# EAGLE design BitBeaconS (EAGLE 7.3.0)
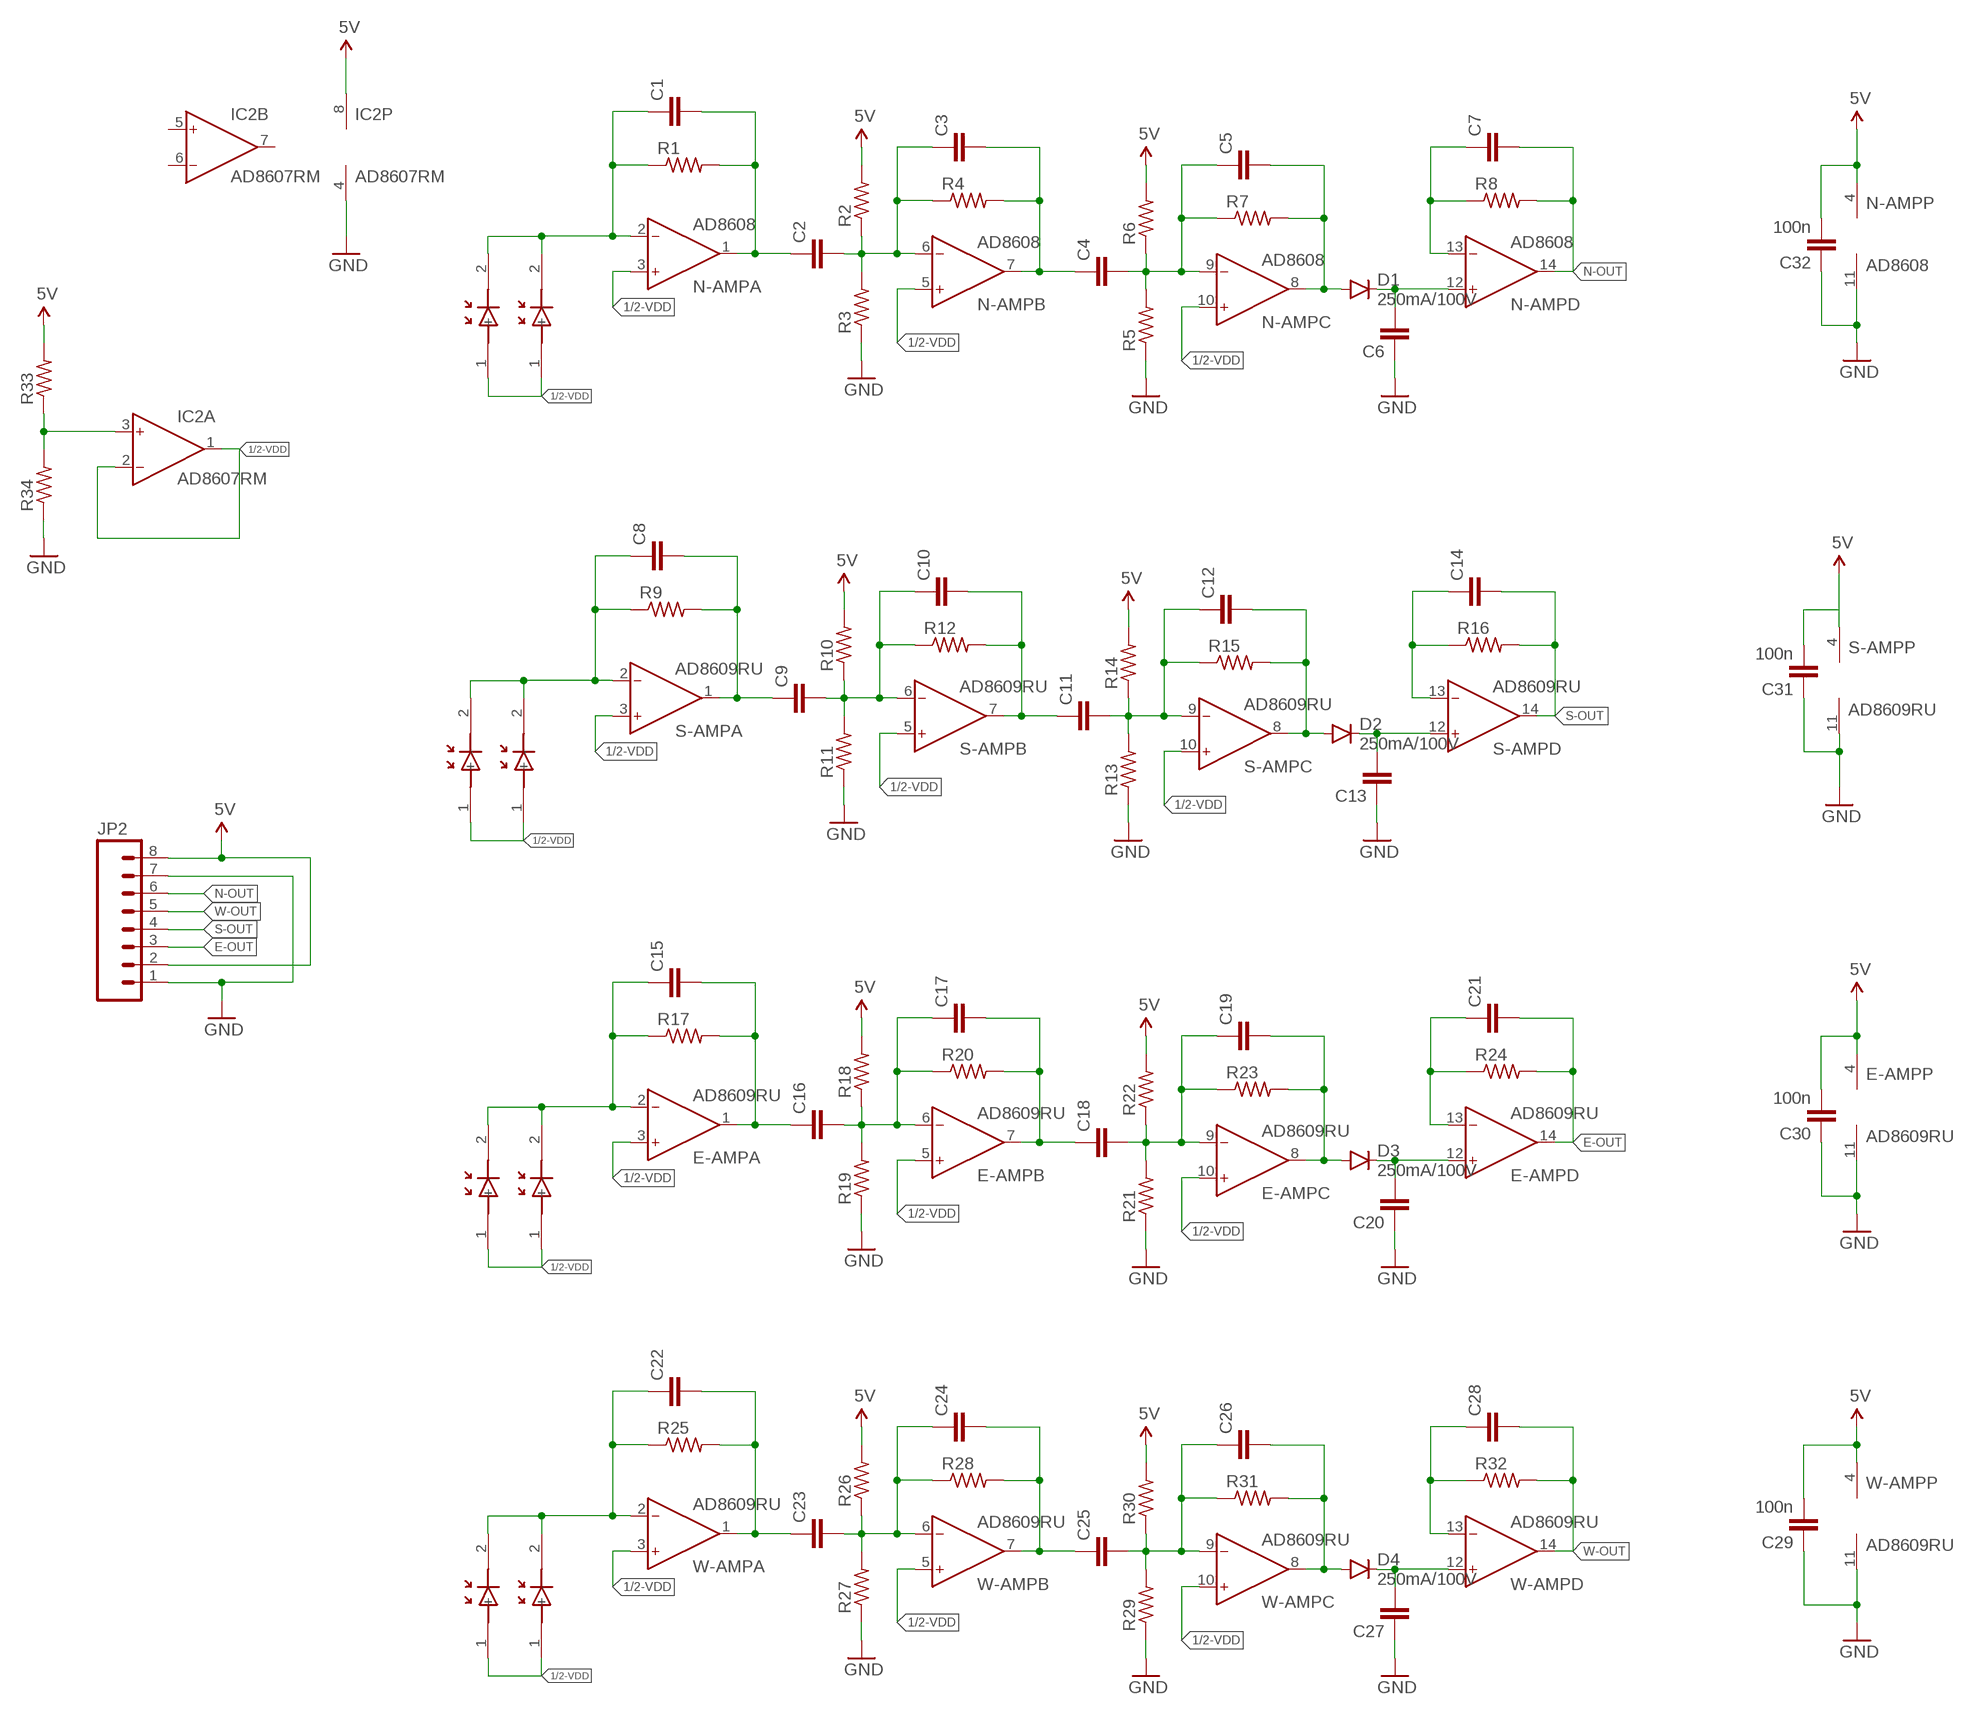
[diagram p0: schematic, sheet 1]

## Parts
C1  C-EUC0805  [C0805]
C2  C-EUC0805  [C0805]
C3  C-EUC0805  [C0805]
C4  C-EUC0805  [C0805]
C5  C-EUC0805  [C0805]
C6  C-EUC0805  [C0805]
C7  C-EUC0805  [C0805]
C8  C-EUC0805  [C0805]
C9  C-EUC0805  [C0805]
C10  C-EUC0805  [C0805]
C11  C-EUC0805  [C0805]
C12  C-EUC0805  [C0805]
C13  C-EUC0805  [C0805]
C14  C-EUC0805  [C0805]
C15  C-EUC0805  [C0805]
C16  C-EUC0805  [C0805]
C17  C-EUC0805  [C0805]
C18  C-EUC0805  [C0805]
C19  C-EUC0805  [C0805]
C20  C-EUC0805  [C0805]
C21  C-EUC0805  [C0805]
C22  C-EUC0805  [C0805]
C23  C-EUC0805  [C0805]
C24  C-EUC0805  [C0805]
C25  C-EUC0805  [C0805]
C26  C-EUC0805  [C0805]
C27  C-EUC0805  [C0805]
C28  C-EUC0805  [C0805]
C29  100n  C-EUC0805  [C0805]
C30  100n  C-EUC0805  [C0805]
C31  100n  C-EUC0805  [C0805]
C32  100n  C-EUC0805  [C0805]
D1  250mA/100V  DIODEBAS16  [SOD-323]
D2  250mA/100V  DIODEBAS16  [SOD-323]
D3  250mA/100V  DIODEBAS16  [SOD-323]
D4  250mA/100V  DIODEBAS16  [SOD-323]
E-AMP  AD8609RU  [TSSOP14]
E-PD  BPW46  [PIN-PHOTODIODE]
E-PD1  BPW46  [PIN-PHOTODIODE]
IC2  AD8607RM  [MSOP08]
JP2  M08NO_SILK  [1X08_PIN1_NO_SILK]
N-AMP  AD8608  AD8609RU  [TSSOP14]
N-PD  BPW46  [PIN-PHOTODIODE]
N-PD1  BPW46  [PIN-PHOTODIODE]
R1  R-US_R0805  [R0805]
R2  R-US_R0805  [R0805]
R3  R-US_R0805  [R0805]
R4  R-US_R0805  [R0805]
R5  R-US_R0805  [R0805]
R6  R-US_R0805  [R0805]
R7  R-US_R0805  [R0805]
R8  R-US_R0805  [R0805]
R9  R-US_R0805  [R0805]
R10  R-US_R0805  [R0805]
R11  R-US_R0805  [R0805]
R12  R-US_R0805  [R0805]
R13  R-US_R0805  [R0805]
R14  R-US_R0805  [R0805]
R15  R-US_R0805  [R0805]
R16  R-US_R0805  [R0805]
R17  R-US_R0805  [R0805]
R18  R-US_R0805  [R0805]
R19  R-US_R0805  [R0805]
R20  R-US_R0805  [R0805]
R21  R-US_R0805  [R0805]
R22  R-US_R0805  [R0805]
R23  R-US_R0805  [R0805]
R24  R-US_R0805  [R0805]
R25  R-US_R0805  [R0805]
R26  R-US_R0805  [R0805]
R27  R-US_R0805  [R0805]
R28  R-US_R0805  [R0805]
R29  R-US_R0805  [R0805]
R30  R-US_R0805  [R0805]
R31  R-US_R0805  [R0805]
R32  R-US_R0805  [R0805]
R33  R-US_R0805  [R0805]
R34  R-US_R0805  [R0805]
S-AMP  AD8609RU  [TSSOP14]
S-PD  BPW46  [PIN-PHOTODIODE]
S-PD1  BPW46  [PIN-PHOTODIODE]
W-AMP  AD8609RU  [TSSOP14]
W-PD  BPW46  [PIN-PHOTODIODE]
W-PD1  BPW46  [PIN-PHOTODIODE]

## Nets
1/2-VDD: E-AMP.3(A:IN+) E-AMP.5(B:IN+) E-AMP.10(C:IN+) E-PD1.1(+) E-PD.1(+) IC2.1(A:OUT) IC2.2(A:IN-) N-AMP.3(A:IN+) N-AMP.5(B:IN+) N-AMP.10(C:IN+) N-PD1.1(+) N-PD.1(+) S-AMP.3(A:IN+) S-AMP.5(B:IN+) S-AMP.10(C:IN+) S-PD1.1(+) S-PD.1(+) W-AMP.3(A:IN+) W-AMP.5(B:IN+) W-AMP.10(C:IN+) W-PD1.1(+) W-PD.1(+)
5V: C29.2 C30.2 C31.2 C32.2 E-AMP.4(P:V+) IC2.8(P:V+) JP2.2 JP2.8 N-AMP.4(P:V+) R2.2 R6.2 R10.2 R14.2 R18.2 R22.2 R26.2 R30.2 R33.2 S-AMP.4(P:V+) W-AMP.4(P:V+)
E-OUT: C21.2 E-AMP.14(D:OUT) JP2.3 R24.2
GND: C6.1 C13.1 C20.1 C27.1 C29.1 C30.1 C31.1 C32.1 E-AMP.11(P:V-) IC2.4(P:V-) JP2.1 JP2.7 N-AMP.11(P:V-) R3.1 R5.1 R11.1 R13.1 R19.1 R21.1 R27.1 R29.1 R34.1 S-AMP.11(P:V-) W-AMP.11(P:V-)
N$1: C1.1 N-AMP.2(A:IN-) N-PD1.2(-) N-PD.2(-) R1.1
N$2: C6.2 D1.C N-AMP.12(D:IN+)
N$3: C1.2 C2.1 N-AMP.1(A:OUT) R1.2
N$4: C8.1 R9.1 S-AMP.2(A:IN-) S-PD1.2(-) S-PD.2(-)
N$5: C2.2 C3.1 N-AMP.6(B:IN-) R2.1 R3.2 R4.1
N$6: C3.2 C4.1 N-AMP.7(B:OUT) R4.2
N$7: C4.2 C5.1 N-AMP.9(C:IN-) R5.2 R6.1 R7.1
N$8: C5.2 D1.A N-AMP.8(C:OUT) R7.2
N$9: IC2.3(A:IN+) R33.1 R34.2
N$11: C7.1 N-AMP.13(D:IN-) R8.1
N$12: C9.2 C10.1 R10.1 R11.2 R12.1 S-AMP.6(B:IN-)
N$13: C10.2 C11.1 R12.2 S-AMP.7(B:OUT)
N$14: C11.2 C12.1 R13.2 R14.1 R15.1 S-AMP.9(C:IN-)
N$15: C12.2 D2.A R15.2 S-AMP.8(C:OUT)
N$16: C13.2 D2.C S-AMP.12(D:IN+)
N$18: C14.1 R16.1 S-AMP.13(D:IN-)
N$19: C15.1 E-AMP.2(A:IN-) E-PD1.2(-) E-PD.2(-) R17.1
N$20: C15.2 C16.1 E-AMP.1(A:OUT) R17.2
N$21: C16.2 C17.1 E-AMP.6(B:IN-) R18.1 R19.2 R20.1
N$22: C17.2 C18.1 E-AMP.7(B:OUT) R20.2
N$23: C18.2 C19.1 E-AMP.9(C:IN-) R21.2 R22.1 R23.1
N$24: C19.2 D3.A E-AMP.8(C:OUT) R23.2
N$25: C20.2 D3.C E-AMP.12(D:IN+)
N$27: C21.1 E-AMP.13(D:IN-) R24.1
N$28: C22.1 R25.1 W-AMP.2(A:IN-) W-PD1.2(-) W-PD.2(-)
N$29: C22.2 C23.1 R25.2 W-AMP.1(A:OUT)
N$30: C23.2 C24.1 R26.1 R27.2 R28.1 W-AMP.6(B:IN-)
N$31: C24.2 C25.1 R28.2 W-AMP.7(B:OUT)
N$32: C25.2 C26.1 R29.2 R30.1 R31.1 W-AMP.9(C:IN-)
N$33: C26.2 D4.A R31.2 W-AMP.8(C:OUT)
N$34: C27.2 D4.C W-AMP.12(D:IN+)
N$36: C28.1 R32.1 W-AMP.13(D:IN-)
N-OUT: C7.2 JP2.6 N-AMP.14(D:OUT) R8.2
S-AMP: C8.2 C9.1 R9.2 S-AMP.1(A:OUT)
S-OUT: C14.2 JP2.4 R16.2 S-AMP.14(D:OUT)
W-OUT: C28.2 JP2.5 R32.2 W-AMP.14(D:OUT)
Unconnected: IC2.5(B:IN+) IC2.6(B:IN-) IC2.7(B:OUT)

## Library data of the parts
C1-C32 = resistor:C-EU: CAPACITOR, European symbol
D1-D4 = SparkFun-DiscreteSemi:DIODE: Diode These are standard reverse protection diodes and small signal diodes. SMA package can handle up to about 1A. SOD-323 can handle about 200mA. What the SOD-323 package when ordering, there are some mfgs out there that are 5-pin packages.; PROD_ID: DIO-09646
E-AMP N-AMP S-AMP W-AMP = analog-devices:AD8609: Precision Micropower, Low Noise CMOS, Rail-to-Rail Input/Output Operational Amplifiers Source: http://www.analog.com/static/imported-files/data_sheets/AD8603_8607_8609.pdf; MF: ALTERA CORPORATION; MPN: AD8609ARUZ; OC_FARNELL: 1464994; OC_NEWARK: 59K6934
E-PD E-PD1 N-PD N-PD1 S-PD S-PD1 W-PD W-PD1 = Orlando:BPW46
IC2 = analog-devices:AD8607: Precision Micropower, Low Noise CMOS, Rail-to-Rail Input/Output Operational Amplifiers Source: http://www.analog.com/static/imported-files/data_sheets/AD8603_8607_8609.pdf; MF: ALTERA CORPORATION; MPN: AD8607ARMZ-REEL; OC_FARNELL: 1464990; OC_NEWARK: 59K6925
JP2 = SparkFun-Connectors:M08: Header 8 Standard 8-pin 0.1" header. Use with straight break away headers (SKU : PRT-00116), right angle break away headers (PRT-00553), swiss pins (PRT-00743), machine pins (PRT-00117), and female headers (PRT-00115).
R1-R34 = resistor:R-US_: RESISTOR, American symbol

## Board
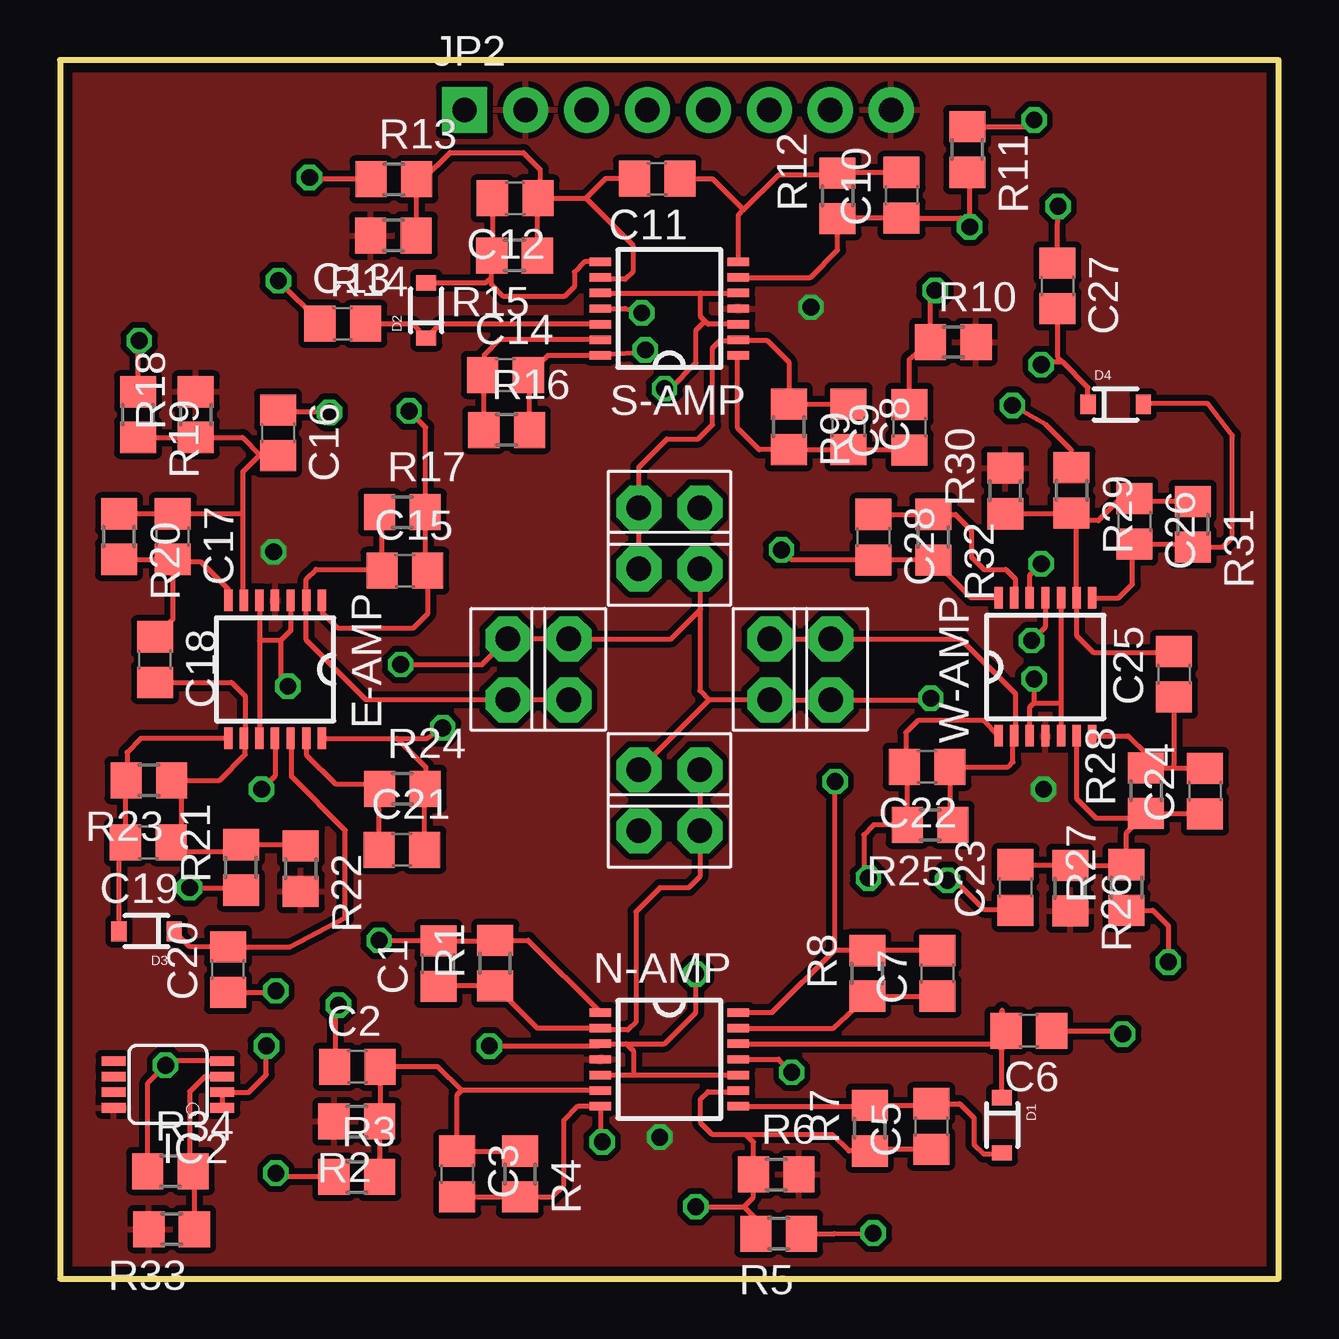
[diagram p1: board, top side]
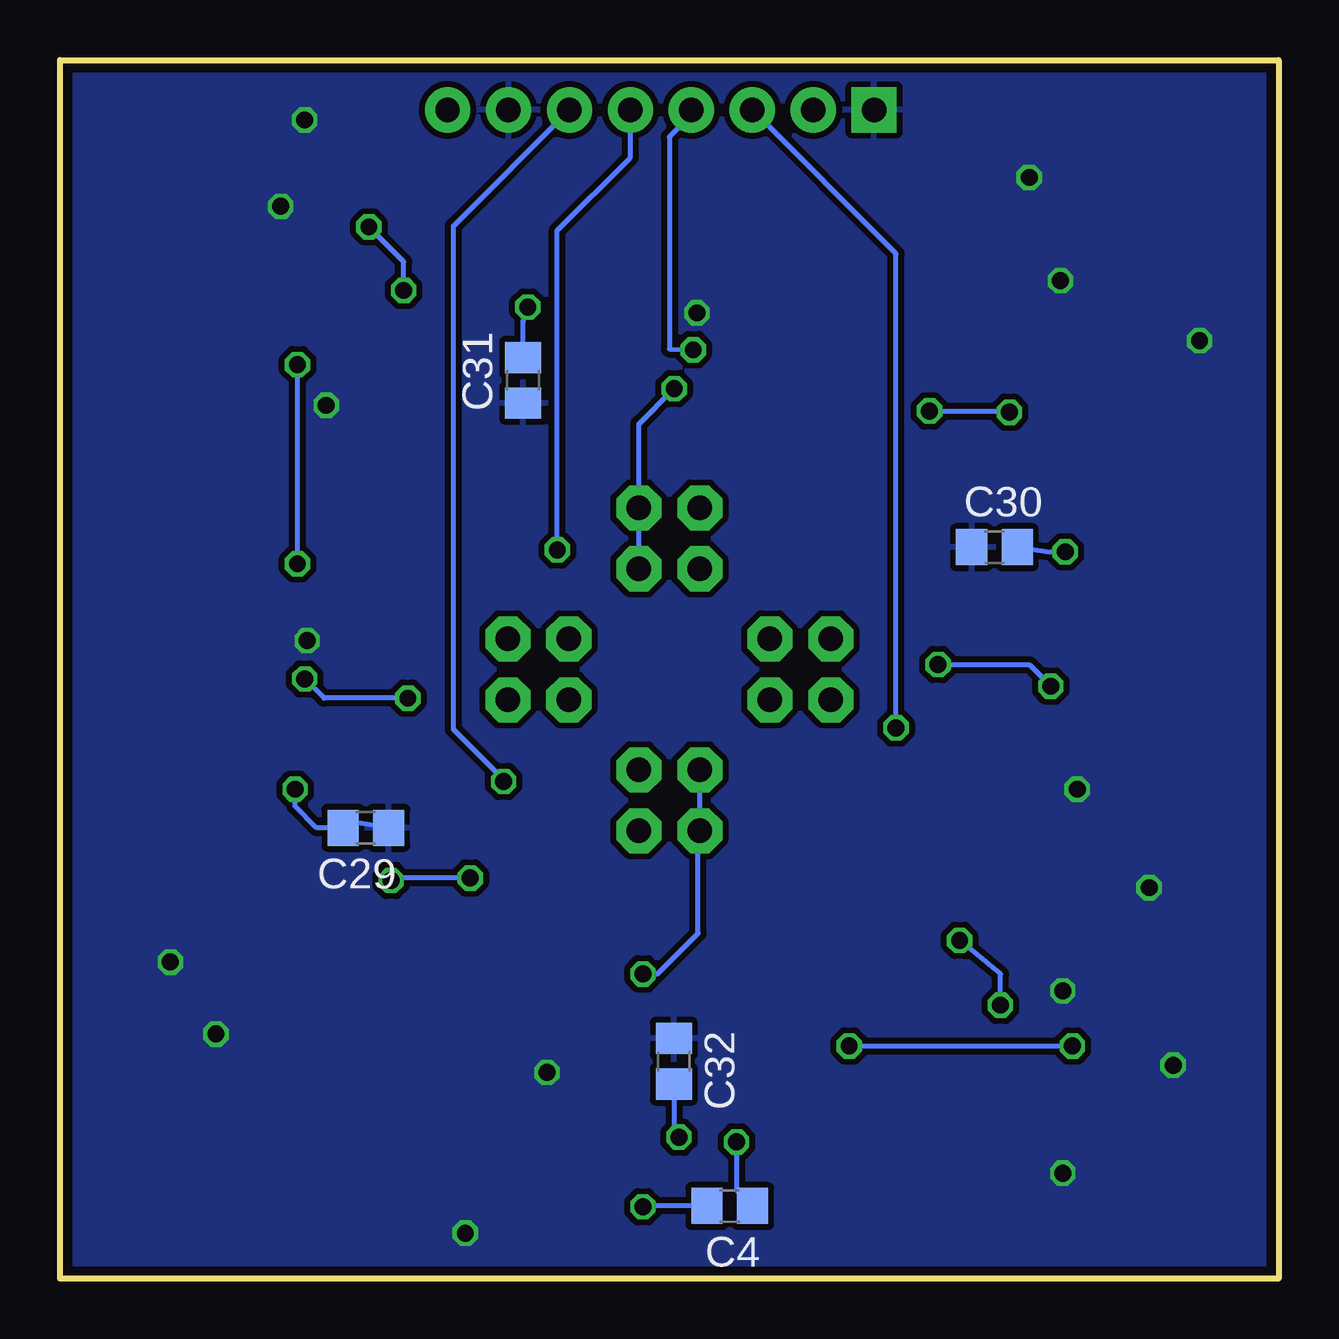
[diagram p2: board, bottom side, seen from below]

Size 50.8 x 50.8 mm. Coordinates in mm from the lower left corner, seen from the top.
Outline: 0,0 50.8,0 50.8,50.8 0,50.8 0,0
Copper layers (1*16): Top 0.0356mm / dielectric 1.5011mm / Bottom 0.0356mm
Design rules "LaenPCBOrder": minimum track width 6mil, minimum drill 13mil, track to track 6mil, track to pad 6mil, pad to pad 6mil, via to via 6mil, smd to smd 6mil, copper to edge 15mil, drill to drill 6mil, minimum pad ring 7mil, minimum via ring 7mil, stop-mask expansion 3mil, vias tented up to drill 0mil, thermal gap 10mil

### Footprints (pad centres in the part's own frame; a part is rotated, then mirrored left to right if it is on the bottom)
C0805 = smd 1.3 x 1.5: 1 -0.95,0; 2 0.95,0
SOD-323 = smd 0.63 x 0.83: A 1.15,0; C -1.15,0
TSSOP14 = smd 0.9 x 0.35: 1 -2.875,1.95; 2 -2.875,1.3; 3 -2.875,0.65; 4 -2.875,0; 5 -2.875,-0.65; 6 -2.875,-1.3; 7 -2.875,-1.95; 8 2.875,-1.95; 9 2.875,-1.3; 10 2.875,-0.65; 11 2.875,0; 12 2.875,0.65; 13 2.875,1.3; 14 2.875,1.95
PIN-PHOTODIODE = drill 1.016 pad 1.88 octagon: 1 -1.27,0; 2 1.27,0
MSOP08 = smd 0.4 x 1: 1 -0.976,-2.263; 2 -0.326,-2.263; 3 0.324,-2.263; 4 0.974,-2.263; 5 0.974,2.262; 6 0.324,2.262; 7 -0.326,2.262; 8 -0.976,2.262
1X08_PIN1_NO_SILK = drill 1.016 pad 1.88 square: 1 0,0 | drill 1.016 pad 1.88: 2 2.54,0; 3 5.08,0; 4 7.62,0; 5 10.16,0; 6 12.7,0; 7 15.24,0; 8 17.78,0
R0805 = smd 1.3 x 1.5: 1 -0.95,0; 2 0.95,0

### Placement (x,y rotation side)
C1  15.77,13.13 90 top
C2  12.4,8.84 0 top
C3  16.56,4.37 270 top
C4  22.88,3.03 180 bottom
C5  36.32,6.35 90 top
C6  40.39,10.34 180 top
C7  36.58,12.73 90 top
C8  32.87,35.51 270 top
C9  35.41,35.48 90 top
C10  35.08,45.16 90 top
C11  24.89,45.85 180 top
C12  18.97,45.03 180 top
C13  11.79,39.8 0 top
C14  18.57,37.67 0 top
C15  14.38,29.51 0 top
C16  9.09,35.26 270 top
C17  4.7,30.94 270 top
C18  3.96,25.81 270 top
C19  3.68,18.19 180 top
C20  7.01,12.89 90 top
C21  14.25,17.88 0 top
C22  36.14,21.34 180 top
C23  39.83,16.31 90 top
C24  47.73,20.32 90 top
C25  46.43,25.2 90 top
C26  44.78,31.57 270 top
C27  41.58,41.38 270 top
C28  33.91,30.91 270 top
C29  38.05,18.79 180 bottom
C30  11.85,30.49 0 bottom
C31  31.5,37.45 90 bottom
C32  25.22,9.07 270 bottom
D1  39.27,6.4 270 top
D2  15.27,40.36 90 top
D3  3.61,14.48 180 top
D4  44,36.44 0 top
E-AMP  8.97,25.4 270 top
E-PD  21.21,25.4 270 top
E-PD1  18.67,25.4 270 top
IC2  4.5,8.1 90 top
JP2  16.87,48.72 0 top
N-AMP  25.4,9.14 0 top
N-PD  25.4,21.21 0 top
N-PD1  25.4,18.67 0 top
R1  18.14,13.16 90 top
R2  12.37,6.55 180 top
R3  12.37,4.24 0 top
R4  19.18,4.37 270 top
R5  29.96,1.88 180 top
R6  29.86,4.34 0 top
R7  33.76,6.27 90 top
R8  33.66,12.73 90 top
R9  30.38,35.51 270 top
R10  37.24,39.04 0 top
R11  37.82,47.07 270 top
R12  32.41,45.14 90 top
R13  13.92,45.82 0 top
R14  13.89,43.48 180 top
R15  18.95,42.65 180 top
R16  18.62,35.38 0 top
R17  14.27,31.95 0 top
R18  5.66,36.02 90 top
R19  3.25,36.02 270 top
R20  2.46,30.94 270 top
R21  7.54,17.14 90 top
R22  10.03,17.09 270 top
R23  3.71,20.78 180 top
R24  14.27,20.42 0 top
R25  36.27,18.91 180 top
R26  42.11,16.28 270 top
R27  44.45,16.31 90 top
R28  45.26,20.35 90 top
R29  42.16,32.86 270 top
R30  39.4,32.84 90 top
R31  47.22,31.45 270 top
R32  36.4,30.91 270 top
R33  4.66,2.06 180 top
R34  4.61,4.48 0 top
S-AMP  25.4,40.44 180 top
S-PD  25.4,29.59 180 top
S-PD1  25.4,32.13 180 top
W-AMP  41.07,25.5 90 top
W-PD  29.59,25.4 90 top
W-PD1  32.13,25.4 90 top

### Tracks (layer width: path | path; a pad name or v marks a point on that pad's centre or on a via)
1/2-VDD  (via drill 0.7)
  Top 0.203: N-AMP.5 23.9,8.49 | 23.9,8.49 N-AMP.10 | 23.61,9.79 N-AMP.3 22.43,9.7 v17.9,9.7 | 23.61,9.79 23.9,9.5 23.9,8.49 | E-AMP.5 8.32,26.6 | 8.32,26.6 E-AMP.10 | E-AMP.3 9.62,27.02 9.2,26.6 | 9.2,26.6 8.32,26.6 | IC2.1 IC2.2 7.87,7.77 8.6,8.5 v8.6,9.7 | 23.61,9.79 25.19,9.79 26.5,11.1 v26.5,12.7 | S-AMP.10 26.7,41.09 | 26.7,41.09 S-AMP.5 | S-AMP.3 27.01,39.79 26.89,39.91 | 26.89,39.91 26.7,40.1 26.7,41.09 | W-AMP.10 41.72,24 | 41.72,24 W-AMP.5 | W-AMP.3 40.42,23.82 40.6,24 | 40.6,24 41.72,24 | v36.3,24.2 36.23,24.13 W-PD1.1 W-PD.1 27.05,24.13 | v40.6,25 40.6,24 | 27.05,24.13 N-PD.1 | 27.05,24.13 26.67,24.51 S-PD.1 26.7,29.56 26.7,27.9 25.47,26.67 E-PD.1 E-PD1.1 17.6,25.6 v14.2,25.6 | v25.2,37.1 25.44,37.1 26.52,38.18 26.52,39.55 26.89,39.91 | 9.2,26.6 9.2,25 v9.5,24.7
  Bottom 0.203: v26.5,12.7 25.9,12.7 24.2,14.4 24.2,18.6 N-PD1.1 N-PD.1 | S-PD.1 S-PD1.1 26.67,35.63 v25.2,37.1 | v36.3,24.2 39.8,24.2 v40.6,25 | v14.2,25.6 10.4,25.6 v9.5,24.7 | v17.9,9.7 v8.6,9.7
5V  (via drill 0.7)
  Bottom 0.203: C32.2 25.22,6.12 v25,5.9 | C30.2 9.49,30.29 v8.9,30.3 | C31.2 31.5,39.9 v31.3,40.5 | C29.2 40.09,18.8 41,19.7 v41,20.4
  pour Top (isolate 0.254): 50.8,50.8 50.8,0 0,0 0,50.8
E-OUT  (via drill 0.7)
  Top 0.203: C21.2 15.2,20.4 R24.2 15.24,20.44 15.24,21.34 14.05,22.52 | E-AMP.14 14.05,22.52 | 14.05,22.52 15.31,22.52 v15.95,22.96
  Bottom 0.203: v15.95,22.96 15.95,42.72 JP2.3
GND  (via drill 0.7)
  Top 0.203: R3.1 9.16,4.24 v9,4.4 | N-AMP.11 29.96,9.14 v30.5,8.6 | R5.1 32.28,1.88 v33.9,1.9 | E-AMP.11 8.97,20.97 v8.4,20.4 | v5.4,16.3 7.44,16.3 R21.1 | IC2.4 4.57,9.07 v4.4,8.9 3.66,8.16 R34.1 | S-AMP.11 23.56,40.44 v24.25,40.26 | C13.1 10.84,39.86 v9.1,41.6 | R13.1 10.48,45.82 v10.4,45.9 | R19.1 3.25,39.05 v3.3,39.1 | C27.1 41.58,43.28 v41.6,44.7 | R29.1 42.16,34.54 41.1,35.6 v39.7,36.4 | W-AMP.11 41.07,27.17 v40.5,26.6 | R11.1 40.32,48.02 v40.6,48.3 | R27.1 45.54,15.36 46.2,14.7 v46.2,13.2 | C6.1 44.16,10.34 v44.3,10.2 | C20.1 8.94,11.94 v9,12
  Bottom 0.203: C29.1 39,19.1 39.1,19.2
  pour Bottom (isolate 0.254): 50.8,50.8 50.8,0 0,0 0,50.8
N$1
  Top 0.203: N-PD.2 N-PD1.2 26.67,16.77 26.2,16.3 25,16.3 24,15.3 24,10.69 23.67,10.36 22.61,10.36 N-AMP.2 19.9,10.44 R1.1 15.8,12.21 C1.1
N$2
  Top 0.203: D1.C 39.27,9.55 | 39.27,9.55 39.27,11.19 C6.2 | N-AMP.12 39.02,9.79 39.27,9.55
N$3  (via drill 0.7)
  Top 0.203: N-AMP.1 19.51,14.11 R1.2 18.11,14.08 C1.2 15.76,14.1 v13.3,14.1 | C2.1 11.48,8.88 11.48,11.28 v11.6,11.4
  Bottom 0.203: v11.6,11.4 11.6,12.7 v13.3,14.1
N$4
  Top 0.203: C8.1 R9.1 30.38,38.2 29.46,39.12 28.25,39.12 S-AMP.2 28.24,39.1 27.5,39.1 27.2,38.8 27.2,35.6 26.6,35 25.3,35 24.13,33.83 S-PD1.2 S-PD.2
N$5
  Top 0.203: N-AMP.6 16.74,7.84 | 16.74,7.84 15.75,8.84 C2.2 13.35,6.58 R2.1 R3.2 | R4.1 C3.1 16.56,7.66 16.74,7.84
N$6  (via drill 0.7)
  Top 0.203: C3.2 R4.2 20.52,3.42 21,3.9 21,6.6 21.6,7.2 N-AMP.7 22.52,5.78 v22.6,5.7
  Bottom 0.203: v22.6,5.7 22.6,3.7 C4.1
N$7  (via drill 0.7)
  Top 0.203: 28.25,7.82 N-AMP.9 28.23,7.8 27,7.8 26.7,7.5 26.7,6.5 27.2,6 28.6,6 | C5.1 33.83,5.4 R7.1 32.88,5.32 32.2,6 28.6,6 | v26.5,3 28.5,3 | 28.5,3 28.9,3.4 R6.1 28.91,5.69 28.6,6 | R5.2 29.01,2.49 28.5,3
  Bottom 0.203: C4.2 26.47,3.03 v26.5,3
N$8
  Top 0.203: N-AMP.8 33.73,7.19 R7.2 36.25,7.22 C5.2 37.5,7.3 38.1,6.7 38.1,5.6 38.5,5.2 39.22,5.2 D1.A
N$9
  Top 0.203: R33.1 5.61,4.43 R34.2 5.4,4.63 5.4,7.8 6.02,8.42 IC2.3
N$11
  Top 0.203: N-AMP.13 32.22,10.44 R8.1 C7.1
N$12  (via drill 0.7)
  Top 0.203: C9.2 35.41,38.34 R10.1 36.29,41.01 v36.47,41.2 | S-AMP.6 31.27,41.74 32.41,42.88 R12.1 32.44,44.21 C10.1 37.55,44.21 v37.92,43.84 37.92,46.02 R11.2
  Bottom 0.203: v36.47,41.2 36.47,42.39 v37.92,43.84
N$13
  Top 0.203: C10.2 32.44,46.11 R12.2 32.35,46.02 29.97,46.02 28.5,44.55 | S-AMP.7 28.27,44.33 28.5,44.55 | C11.1 27.2,45.85 28.5,44.55
N$14
  Top 0.203: R14.1 14.87,43.51 R13.2 15.14,45.82 16.26,46.94 19.3,46.94 20.02,46.23 20.02,45.13 C12.1 | C12.1 21.92,45.03 | 21.92,45.03 23.88,43.08 23.88,41.96 23.57,41.66 22.61,41.66 S-AMP.9 | R15.1 19.9,45.01 C12.1 | C11.2 22.73,45.85 21.92,45.03
N$15
  Top 0.203: C12.2 18.02,42.67 R15.2 17.98,42.63 17.98,41.76 | S-AMP.8 21.86,42.39 21.44,41.96 21.44,41.35 21.03,40.95 18.49,40.95 17.98,41.45 17.98,41.76 | D2.A 17.74,41.51 17.98,41.76
N$16
  Top 0.203: C13.2 14.67,39.8 D2.C 15.84,39.79 S-AMP.12
N$18
  Top 0.203: S-AMP.13 18.31,39.14 17.68,38.51 17.68,37.73 C14.1 17.67,37.62 R16.1
N$19
  Top 0.203: E-PD.2 E-PD1.2 12.75,24.13 10.26,26.62 E-AMP.2 10.27,29.16 10.67,29.57 13.38,29.57 C15.1 13.43,31.85 R17.1
N$20  (via drill 0.7)
  Top 0.203: E-AMP.1 10.92,27.79 11.58,27.13 14.73,27.13 15.34,27.74 15.34,29.5 C15.2 15.22,29.62 R17.2 15.24,31.97 15.24,35.48 v14.55,36.17 | v11.23,36.12 9.18,36.12 C16.1
  Bottom 0.203: v14.55,36.17 11.28,36.17 v11.23,36.12
N$21
  Top 0.203: 7.62,31.9 7.62,33.63 8.33,34.34 | 7.62,31.9 7.62,28.32 E-AMP.6 | R19.2 R18.1 7.61,35.07 8.33,34.34 | R20.1 C17.1 7.61,31.89 7.62,31.9 | 8.33,34.34 9.06,34.34 C16.2
N$22
  Top 0.203: R20.2 C17.2 | E-AMP.7 7.02,28.75 5.89,29.87 4.82,29.87 C17.2 | C17.2 4.7,27.49 C18.1
N$23
  Top 0.203: C18.2 7.15,24.86 7.72,24.28 7.72,22.58 E-AMP.9 7.72,22.47 7.72,21.84 6.66,20.78 R23.1 5.07,20.37 5.07,17.8 | 5.07,17.8 C19.1 | 5.07,17.8 7.76,17.8 R21.2 10.39,18.09 R22.1
N$24
  Top 0.203: 3.25,20.46 R23.2 | 3.25,17.89 C19.2 | E-AMP.8 3.37,22.52 2.79,21.95 2.79,20.81 R23.2 | C19.2 2.73,20.75 R23.2 | D3.A 2.46,17.91 C19.2
N$25
  Top 0.203: 4.96,14.48 D3.C 5.41,13.84 C20.2 9.59,13.84 11.89,15.04 11.89,18.69 9.65,20.93 9.65,22.49 E-AMP.12
N$27
  Top 0.203: E-AMP.13 10.27,21.84 11.48,20.62 13.12,20.62 R24.1 13.3,20.4 C21.1
N$28
  Top 0.203: W-PD.2 W-PD1.2 37.54,26.67 39.83,24.38 39.83,22.68 W-AMP.2 39.73,22.58 39.73,21.54 39.52,21.34 C22.1 37.09,18.54 R25.1
N$29  (via drill 0.7)
  Top 0.203: W-AMP.1 39.12,22.65 38.51,23.27 35.76,23.27 35.26,22.76 35.26,21.4 C22.2 35.32,21.21 R25.2 33.91,18.91 33.5,18.5 33.5,16.9 v33.7,16.7 | v37,16.6 37.3,16.6 38.5,15.4 39.78,15.4 C23.1
  Bottom 0.203: v33.7,16.7 36.9,16.7 v37,16.6
N$30
  Top 0.203: C23.2 42.09,17.26 R26.1 44.42,17.23 R27.2 44.45,18.58 R28.1 45.82,19.39 | 45.82,19.39 47.7,19.39 C24.1 | W-AMP.6 42.37,20.01 43.18,19.2 45.63,19.2 45.82,19.39
N$31
  Top 0.203: C24.2 46.33,21.27 | 46.33,21.27 45.29,21.27 R28.2 45.31,21.35 45.31,21.84 44.53,22.63 W-AMP.7 | C25.1 46.43,21.37 46.33,21.27
N$32
  Top 0.203: C25.2 46.4,26.11 43.08,26.11 42.37,26.82 W-AMP.9 42.37,31.7 R29.2 | R31.1 44.91,32.4 C26.1 44.21,32.52 43.28,31.6 42.18,31.6 R29.2 | 42.14,31.59 R29.2 | R30.1 42.14,31.89 R29.2
N$33
  Top 0.203: W-AMP.8 44.12,28.38 44.7,28.96 44.7,30.55 C26.2 47.09,30.62 R31.2 48.48,30.5 48.87,30.89 48.87,35.15 47.85,36.47 45.18,36.47 D4.A
N$34  (via drill 0.7)
  Top 0.203: 40.4,28.3 40.42,28.32 W-AMP.12 40.42,29.32 v40.9,29.8 | D4.C 42.85,37.15 41.8,38.2 | 41.8,38.2 41,38.2 v40.9,38.1 | C27.2 41.58,38.42 41.8,38.2
  Bottom 0.203: v40.9,29.8 v40.9,38.1
N$36
  Top 0.203: C28.1 R32.1 37.33,31.86 38,31.19 38,30.07 38.51,29.57 39.42,29.57 39.83,29.16 39.83,28.43 W-AMP.13
N-OUT  (via drill 0.7)
  Top 0.203: C7.2 R8.2 33.59,13.72 32.31,13.72 | N-AMP.14 29.69,11.09 32.31,13.72 | 32.31,13.72 v32.31,20.73
  Bottom 0.203: v32.31,20.73 32.31,20.81 34.4,22.9 34.4,43.88 JP2.6
S-AMP
  Top 0.203: C9.1 35.38,34.56 C8.2 R9.2 29.14,34.56 28.25,35.46 28.25,38.46 S-AMP.1
S-OUT  (via drill 0.7)
  Top 0.203: R16.2 19.57,37.62 C14.2 20.34,38.49 S-AMP.14 22.54,38.5 24.28,38.6 v24.4,38.72
  Bottom 0.203: JP2.4 24.49,48.51 25.4,47.6 25.4,38.75 v24.4,38.72
W-OUT  (via drill 0.7)
  Top 0.203: W-AMP.14 37.98,28.38 R32.2 C28.2 30.49,29.96 v30.07,30.38
  Bottom 0.203: v30.07,30.38 30.07,43.69 27.03,46.74 JP2.5